# EasyEDA Pro project ProPrj_机器人控制器电源1号_2024-10-14.epro

# Schematic Schematic1
Board Name: Board1; Create Date: 2024-10-03
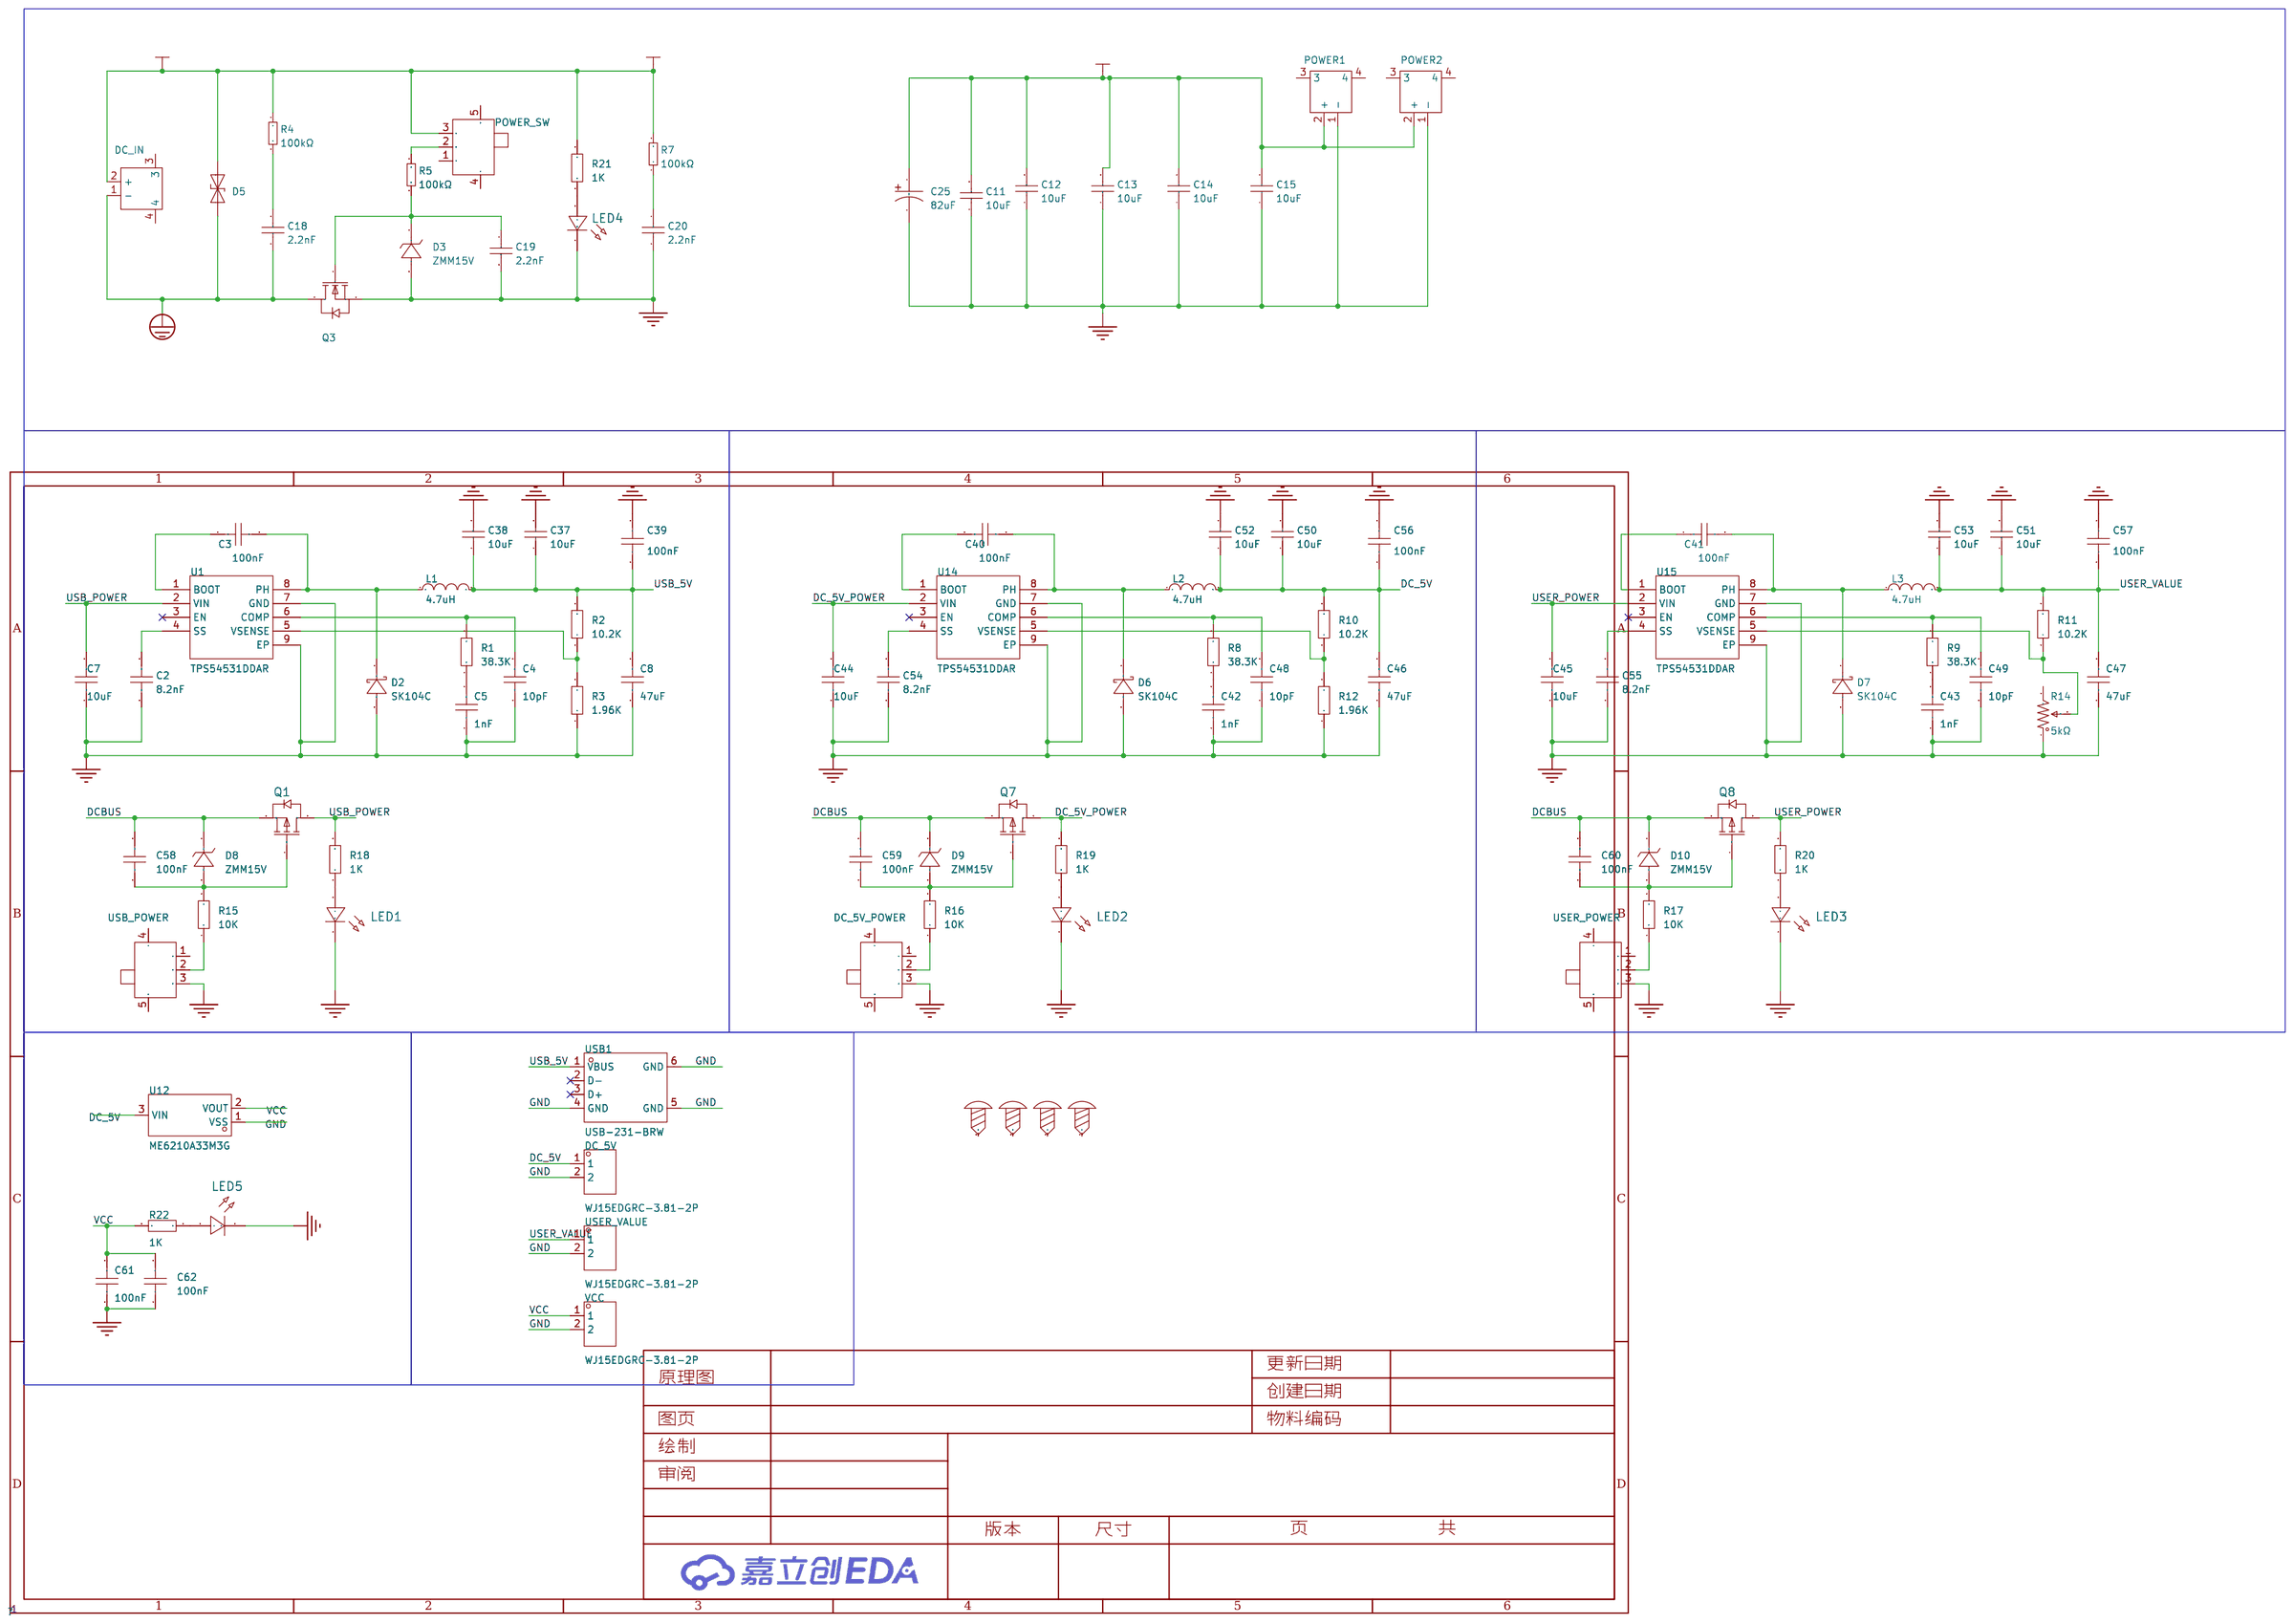
[diagram p0: schematic sheet]

## Parts
C2  8.2nF  [C0603]
C3  100nF  [C0603]
C4  10pF  [C0603]
C5  1nF  [C0603]
C7  10uF  [C1210]
C8  47uF  [C1210]
C11  10uF  [C1206_S]
C12  10uF  [C1206_S]
C13  10uF  [C1206_S]
C14  10uF  [C1206_S]
C15  10uF  [C1206_S]
C18  2.2nF  [C0603]
C19  2.2nF  [C0603]
C20  2.2nF  [C0603]
C25  82uF  [CAP-SMD_BD10.0-L10.3-W10.3-LS11.0-R-RD]
C37  10uF  [C1206_S]
C38  10uF  [C1206_S]
C39  100nF  [C0603]
C40  100nF  [C0603]
C41  100nF  [C0603]
C42  1nF  [C0603]
C43  1nF  [C0603]
C44  10uF  [C1210]
C45  10uF  [C1210]
C46  47uF  [C1210]
C47  47uF  [C1210]
C48  10pF  [C0603]
C49  10pF  [C0603]
C50  10uF  [C1206_S]
C51  10uF  [C1206_S]
C52  10uF  [C1206_S]
C53  10uF  [C1206_S]
C54  8.2nF  [C0603]
C55  8.2nF  [C0603]
C56  100nF  [C0603]
C57  100nF  [C0603]
C58  100nF  [C0603]
C59  100nF  [C0603]
C60  100nF  [C0603]
C61  100nF  [C0603]
C62  100nF  [C0603]
D2  SK104C  [SMC_L6.9-W5.9-LS7.9-RD]
D3  ZMM15V  [LL-34_L3.5-W1.5-RD-2]
D5  1.5SMC30CAHE3/57T  [SMC_L6.8-W5.9-LS7.8-BI]
D6  SK104C  [SMC_L6.9-W5.9-LS7.9-RD]
D7  SK104C  [SMC_L6.9-W5.9-LS7.9-RD]
D8  ZMM15V  [LL-34_L3.5-W1.5-RD-2]
D9  ZMM15V  [LL-34_L3.5-W1.5-RD-2]
D10  ZMM15V  [LL-34_L3.5-W1.5-RD-2]
DC_5V  WJ15EDGRC-3.81-2P  [CONN-TH_2P-P3.81_WJ15EDGRC-3.81-2P]
DC_5V_POWER  SS12D07VG4 087  [SW-TH_SS12D07VG4]
DC_IN  XT30PW-M30.G.Y  [CONN-TH_XT30PW-M]
L1  4.7uH  [IND-SMD_L7.3-W6.6_MHCI06030]
L2  4.7uH  [IND-SMD_L7.3-W6.6_MHCI06030]
L3  4.7uH  [IND-SMD_L7.3-W6.6_MHCI06030]
LED1  -  [LED_0603]
LED2  -  [LED_0603]
LED3  -  [LED_0603]
LED4  -  [LED_0603]
LED5  -  [LED_0603]
POWER1  XT30PW-M30.G.Y  [CONN-TH_XT30PW-M]
POWER2  XT30PW-M30.G.Y  [CONN-TH_XT30PW-M]
POWER_SW  SS12D07VG4 087  [SW-TH_SS12D07VG4]
Q1  WSD90P06DN56  [DFN-8_L5.8-W4.9-P1.27-LS6.0-BL-1]
Q3  WSD80120DN56  [DFN-8_L5.8-W4.9-P1.27-LS6.0-BL-1]
Q7  WSD90P06DN56  [DFN-8_L5.8-W4.9-P1.27-LS6.0-BL-1]
Q8  WSD90P06DN56  [DFN-8_L5.8-W4.9-P1.27-LS6.0-BL-1]
R1  38.3K  [R0603]
R2  10.2K  [R0603]
R3  1.96K  [R0603]
R4  100kΩ  [R0603]
R5  100kΩ  [R0603]
R7  100kΩ  [R0603]
R8  38.3K  [R0603]
R9  38.3K  [R0603]
R10  10.2K  [R0603]
R11  10.2K  [R0603]
R12  1.96K  [R0603]
R14  5kΩ  [RES-ADJ-TH_3362P]
R15  10K  [R0603]
R16  10K  [R0603]
R17  10K  [R0603]
R18  1K  [R0603]
R19  1K  [R0603]
R20  1K  [R0603]
R21  1K  [R0603]
R22  1K  [R0603]
SCREW1  -  [M3螺丝]
SCREW2  -  [M3螺丝]
SCREW3  -  [M3螺丝]
SCREW4  -  [M3螺丝]
U1  TPS54531DDAR  [SOIC-8_L5.0-W4.0-P1.27-LS6.0-BL-EP2.0]
U12  ME6210A33M3G  [SOT-23-3_L3.0-W1.7-P0.95-LS2.9-BR]
U14  TPS54531DDAR  [SOIC-8_L5.0-W4.0-P1.27-LS6.0-BL-EP2.0]
U15  TPS54531DDAR  [SOIC-8_L5.0-W4.0-P1.27-LS6.0-BL-EP2.0]
USB1  USB-231-BRW  [USB-A-TH_USB-231-ARY]
USB_POWER  SS12D07VG4 087  [SW-TH_SS12D07VG4]
USER_POWER  SS12D07VG4 087  [SW-TH_SS12D07VG4]
USER_VALUE  WJ15EDGRC-3.81-2P  [CONN-TH_2P-P3.81_WJ15EDGRC-3.81-2P]
VCC  WJ15EDGRC-3.81-2P  [CONN-TH_2P-P3.81_WJ15EDGRC-3.81-2P]

## Library data of the parts
C2-C5 C39-C43 C48 C49 C54-C62 = CAP_0603: Supplier Footprint: 0603
C7 C44 C45 = CL32B106KBJNNNE: 容值:10uF;精度:±10%;额定电压:50V;材质(温度系数):X7R;; LCSC Part Name: 10uF ±10% 50V; Supplier Part: C138687; Manufacturer: SAMSUNG(三星); Supplier Footprint: 1210; JLCPCB Part Class: 扩展库; Datasheet: https://atta.szlcsc.com/upload/public/pdf/source/20190426/C138687_F326FA7378191C6A10A83DC717674AAD.pdf; Supplier: LCSC; Tolerance: ±10%; Voltage Rated: 50V; Temperature Coefficient: X7R
C8 C46 C47 = CC1210KKX5R7BB476: 容值:47uF;精度:±10%;额定电压:16V;材质(温度系数):X5R;; LCSC Part Name: 47uF ±10% 16V; Supplier Part: C596320; Manufacturer: YAGEO(国巨); Supplier Footprint: 1210; JLCPCB Part Class: 扩展库; Datasheet: https://atta.szlcsc.com/upload/public/pdf/source/20200609/C596320_4AA18BB2F8C351B9C9A1DF92409464C0.pdf; Supplier: LCSC; Tolerance: ±10%; Voltage Rated: 16V; Temperature Coefficient: X5R
C11-C15 C37 C38 C50-C53 = C1206_S: Pin Type: IN; 值: 10UF
C18-C20 = 0603B222K500NT: 容值:2.2nF;精度:±10%;额定电压:50V;材质(温度系数):X7R;; LCSC Part Name: 2.2nF ±10% 50V; Supplier Part: C1604; Manufacturer: FH(风华); Supplier Footprint: 0603; JLCPCB Part Class: Basic Part; Datasheet: https://atta.szlcsc.com/upload/public/pdf/source/20200305/C486355_26A10D38EF8C2A5C37091D0039909270.pdf; Supplier: LCSC; Tolerance: ±10%; Voltage Rated: 50V; Temperature Coefficient: X7R; Pin Type: IN
C25 = VKME1001K820MV: 容值:82uF;精度:±20%;额定电压:80V;纹波电流:668mA@100kHz;等效串联电阻:-;; LCSC Part Name: 82uF ±20% 80V; Supplier Part: C487408; Manufacturer: Ymin(永铭); Supplier Footprint: SMD,D10xL10mm; JLCPCB Part Class: 扩展库; Datasheet: https://atta.szlcsc.com/upload/public/pdf/source/20200220/C487408_31B911397251F741AFB3AE80DF240EFB.pdf; Supplier: LCSC; Tolerance: ±20%; Rated Voltage: 80V; φD: 10mm; L: 10mm; Ripple Current: 668mA@100kHz; Lifetime @ Temp: 10000hrs@105℃; Operating Temperature: -55℃~+105℃
D2 D6 D7 = SK104C_C18199211: 二极管配置:独立式;正向压降(Vf):550mV@10A;直流反向耐压(Vr):40V;平均整流电流(Io):10A;; LCSC Part Name: 电压:40V 电流:10A; Supplier Part: C18199211; Manufacturer: 宏迦橙; Supplier Footprint: SMC; JLCPCB Part Class: 扩展库; Datasheet: https://atta.szlcsc.com/upload/public/pdf/source/20230925/90F2340DC9BC2B2517F18AABBBD1A464.pdf; Supplier: LCSC; Diode Configuration: 独立式; Forward Voltage (Vf@If): 550mV@10A; Reverse Voltage (Vr): 40V; Average Rectified Current (Io): 10A; Reverse Leakage Current (Ir): 500uA@40V; Peak forward surge current: 175A
D3 D8-D10 = ZMM15V: 二极管配置:独立式;稳压值(标称值):15V;稳压值(范围):13.8V~15.6V;功率:500mW;精度:±5%;; Supplier Part: C2891755; Manufacturer: YONGYUTAI(永裕泰); Supplier Footprint: LL-34; JLCPCB Part Class: Extended Part; Datasheet: https://atta.szlcsc.com/upload/public/pdf/source/20210901/1E62BEB6ADBB84BC625F53DAC2865793.pdf; Supplier: LCSC; Diode Configuration: 独立式; Zener Voltage (Nom): 15V; Zener Voltage (Range): 13.8V~15.6V; Power Dissipation: 500mW; Zener Impedance (Zzt): 30Ω; Tolerance: ±5%
D5 = 1.5SMC30CAHE3/57T: Supplier Part: C266791; Manufacturer: VISHAY(威世); Supplier Footprint: DO-214AB; JLCPCB Part Class: ExtendedPart; Datasheet: https://atta.szlcsc.com/upload/public/pdf/source/20201127/C266791_DCFCBF6E8C40544EF502CA57B31F9E9C.pdf; Supplier: LCSC
DC_5V USER_VALUE VCC = WJ15EDGRC-3.81-2P: 连接器类型:板端/插座-闭口;固定方式:-;结构:1x2P;间距:3.81mm;颜色:-;安装方式:弯针;排数:1;每排PIN数:2;额定电流:8A;额定电压:300V;线规 - AWG:-;线规 - 平方毫米:-;触头材质:黄铜;触头镀层:锡;工作温度范围:-40℃~+105℃;焊接温度(最大值):-;; LCSC Part Name: 1x2P 3.81mm 排数:1 每排P数:2; Supplier Part: C8387; Manufacturer: KANGNEX(康奈克斯电气); Supplier Footprint: 弯插,P=3.81mm; JLCPCB Part Class: 扩展库; Datasheet: https://atta.szlcsc.com/upload/public/pdf/source/20191225/C8387_8EBAF10345D2762F0167C8753398EEFA.pdf; Supplier: LCSC; Connector Type: 板端/插座-闭口; Structure: 1x2P; Pitch: 3.81mm; Mounting Style: 弯针; Number of Pins: 2P; Number of Rows: 1; Number of PINs Per Row: 2; Current Rating (Max): 8A; Voltage Rating (Max): 300V; Contact Material: 黄铜; Contact Plating: 锡; Operating Temperature Range: -40℃~+105℃
DC_5V_POWER POWER_SW USB_POWER USER_POWER = SS12D07VG4 087: 电路结构:单刀双掷;安装方式:直插;开关颜色:-;额定电流(DC):500mA;额定电压(DC):50V;额定电流(AC):-;额定电压(AC):-;机械寿命:5千次;; Supplier Part: C2939726; Manufacturer: SHOU HAN(首韩); Supplier Footprint: 插件; JLCPCB Part Class: 扩展库; Datasheet: https://atta.szlcsc.com/upload/public/pdf/source/20220106/E715996F66241B9FD900079FF66489BE.pdf; Supplier: LCSC; Circuit: 单刀双掷; Pin Style: PC引脚; Switch Length: 8.7mm; Switch Width: 4.4mm; Switch Height: 4.7mm; Mounting Style: 直插; Current Rating (DC): 500mA; Voltage Rating (DC): 50V; Mechanical Life: 5千次; Operating Temperature: -10℃~+50℃
DC_IN POWER1 POWER2 = XT30PW-M30.G.Y: 类别:-;类型1:-;; LCSC Part Name: AMASS(艾迈斯)航模插头 卧式弯脚 XT30PW-M公头; Supplier Part: C431092; Manufacturer: AMASS(艾迈斯); JLCPCB Part Class: 扩展库; Datasheet: https://atta.szlcsc.com/upload/public/pdf/source/20220222/6A9F22F7850E25B33E1BE430ADF8560B.pdf; Supplier: LCSC; Type: 航模插头; RatedVoltage: DC 500V; InterfaceType: 公头; RatedCurrent: 15A; RecommendedWireGauge: 16/18/20AWG; contact resistance: 1.2mΩ; specifications: 2pin
L1-L3 = SMMS0630-4R7M: 电感值:4.7uH;精度:±20%;额定电流:-;饱和电流(Isat):6.55A;类型:一体成型电感;; LCSC Part Name: 4.7uH ±20% 6.55A; Supplier Part: C128688; Manufacturer: SXN(顺翔诺); Supplier Footprint: SMD,6.6x7.3mm; JLCPCB Part Class: 扩展库; Datasheet: https://atta.szlcsc.com/upload/public/pdf/source/20210810/BBF24330FB2F5029F637830BA9C42C0D.pdf; Supplier: LCSC; Tolerance: ±20%; Saturation Current (Isat): 6.55A; DC Resistance (DCR): 40mΩ; Type: 一体成型电感
LED1-LED5 = LED_0603-R: Supplier Footprint: 0603
Q1 Q7 Q8 = WSD90P06DN56: Supplier: LCSC; Supplier Part: C719104; JLCPCB Part Class: ExtendedPart; Manufacturer: WinsokSemicon
Q3 = WSD80120DN56: Configuration Single Type N-Ch VDS(V) 85 VGS(V) 25 ID(A)Max. 120 VGS(th)(v) 3 RDS(ON)(m?)@4.218V - Qg(nC)@4.5V - QgS(nC) 17 Qgd(nC) 11 Ciss(pF) 3750 Coss(pF) 395 Crss(pF) 180; Supplier Part: C2880467; Manufacturer: WINSOK(微硕); Supplier Footprint: DFN-8(4.9x5.8); JLCPCB Part Class: 扩展库; Datasheet: https://atta.szlcsc.com/upload/public/pdf/source/20210813/DD2210B50993633CFB622FAE7AD52E64.pdf; Supplier: LCSC; Check: true
R1-R3 R8-R12 R15-R22 = Res_0603: Supplier Footprint: 0603
R4 R5 R7 = RC0603FR-07100KL: 电阻类型:厚膜电阻;阻值:100kΩ;精度:±1%;功率:100mW;最大工作电压:75V;温度系数:±100ppm/℃;; LCSC Part Name: 厚膜电阻 100kΩ ±1% 100mW; Supplier Part: C14675; Manufacturer: YAGEO(国巨); Supplier Footprint: 0603; JLCPCB Part Class: Extended Part; Datasheet: https://atta.szlcsc.com/upload/public/pdf/source/20140324/1457707028752.pdf; Supplier: LCSC; Type: 厚膜电阻; Tolerance: ±1%; Power(Watts): 100mW; Overload Voltage (Max): 75V; Temperature Coefficient: ±100ppm/℃; Operating Temperature Range: -55℃~+155℃; Pin Type: IN
R14 = 3362P-1-502: 阻值:5kΩ;精度:±10%;; LCSC Part Name: 5kΩ ±10%; Supplier Part: C118903; Manufacturer: BOCHEN(博晨); Supplier Footprint: 插件; JLCPCB Part Class: 扩展库; Datasheet: https://atta.szlcsc.com/upload/public/pdf/source/20171114/C118903_15106326539181117393.pdf; Supplier: LCSC; Tolerance: ±10%
SCREW1-SCREW4 = M3螺丝: Supplier Footprint: 插件
U1 U14 U15 = TPS54531DDAR: 功能类型:降压型;输出类型:可调;输入电压:3.5V~28V;输出电压:800mV~26.04V;输出电流(最大值):5A;; Supplier Part: C50605; Manufacturer: TI(德州仪器); Supplier Footprint: SOIC-8-EP; JLCPCB Part Class: 扩展库; Datasheet: https://www.ti.com/cn/lit/gpn/tps54531; Supplier: LCSC; Function: 降压型; Output Type: 可调; Input Voltage: 3.5V~28V; Output Voltage: 800mV~26.04V; Output Current (Max): 5A; Switching Frequency: 570kHz; Operating Temperature: -40℃~+85℃@(TA); Synchronous Rectification: 否; Number of Outputs: 1; Topology: 降压式; Switch tube (built-in/external): 内置
U12 = ME6210A33M3G: 输出类型:固定;最大输入电压:18V;输出电压:3.3V;最大输出电流:500mA;电源纹波抑制比(PSRR):-;输出极性:正极;; LCSC Part Name: 输入18V 输出3.3V 500mA; Supplier Part: C236680; Manufacturer: MICRONE(南京微盟); Supplier Footprint: SOT-23; JLCPCB Part Class: 扩展库; Datasheet: https://atta.szlcsc.com/upload/public/pdf/source/20190709/C403652_164B03470289BC6E2EF0FCF22B47472A.pdf; Supplier: LCSC; Output Type: 固定; Maximum Input Voltage: 18V; Output Voltage: 3.3V; MAX Output Current: 500mA; Dropout Voltage: 260mV@(200mA); Output Polarity: 正极; Number of Outputs: 1
USB1 = USB-231-BRW: 连接器类型:Type-A;标准:USB 2.0;公母:母;端口数量:1;触点数量:4P;安装方式:弯插;额定电流 - 电源:1.5A;触头材质:-;触头镀层:-;工作温度范围:-20℃~+70℃;焊接温度(最大值):260℃;; LCSC Part Name: Type-A 母 弯插; Supplier Part: C720526; Manufacturer: XUNPU(讯普); Supplier Footprint: 插件; JLCPCB Part Class: 扩展库; Datasheet: https://atta.szlcsc.com/upload/public/pdf/source/20200810/C720526_4837E23757308E8DFF7007387B1B5646.pdf; Supplier: LCSC; Connector Type: Type-A; Standard: USB 2.0; Gender: 母; Number of Ports: 1; Number of Contacts: 4P; Mounting Style: 弯插; Current Rating - Power (Max): 1.5A; Operating Temperature Range: -20℃~+70℃; Soldering Temperature(Max): 260℃

## Nets
GND: C2.1 C4.1 C5.1 C7.1 C8.1 C11.1 C12.1 C13.1 C14.1 C15.1 C19.2 C20.2 C25.2 C37.2 C38.2 C39.2 C42.1 C43.1 C44.1 C45.1 C46.1 C47.1 C48.1 C49.1 C50.2 C51.2 C52.2 C53.2 C54.1 C55.1 C56.2 C57.2 C61.1 C62.1 D2.2(A) D3.2(A) D6.2(A) D7.2(A) DC_5V.2 DC_5V_POWER.3 LED1.1(C) LED2.1(C) LED3.1(C) LED4.1(C) LED5.1(C) POWER1.1(-) POWER2.1(-) Q3.3(S) R3.1 R12.1 R14.1 U1.7(GND) U1.9(EP) U12.1(VSS) U14.7(GND) U14.9(EP) U15.7(GND) U15.9(EP) USB1.4(GND) USB1.5(GND) USB1.6(GND) USB_POWER.3 USER_POWER.3 USER_VALUE.2 VCC.2
PGND: C18.2 D5.1(K) DC_IN.1(-) Q3.2(D)
VCC: C61.2 C62.2 R22.2 U12.2(VOUT) VCC.1
DC_5V: C46.2 C50.1 C52.1 C56.1 DC_5V.1 L2.2 R10.2 U12.3(VIN)
DC_5V_POWER: C44.2 Q7.2(D) R19.2 U14.2(VIN)
DCBUS: C11.2 C12.2 C13.2 C14.2 C15.2 C25.1 C58.2 C59.2 C60.2 D5.2(A) D8.1(K) D9.1(K) D10.1(K) DC_IN.2(+) POWER1.2(+) POWER2.2(+) POWER_SW.3 Q1.3(S) Q7.3(S) Q8.3(S) R4.2 R7.2 R21.2
USB_5V: C8.2 C37.1 C38.1 C39.1 L1.2 R2.2 USB1.1(VBUS)
USB_POWER: C7.2 Q1.2(D) R18.2 U1.2(VIN)
USER_POWER: C45.2 Q8.2(D) R20.2 U15.2(VIN)
USER_VALUE: C47.2 C51.1 C53.1 C57.1 L3.2 R11.2 USER_VALUE.1
$1N473: C2.2 U1.4(SS)
$1N474: C3.1 U1.1(BOOT)
$1N475: C5.2 R1.1
$1N478: C3.2 D2.1(K) L1.1 U1.8(PH)
$1N479: C4.2 R1.2 U1.6(COMP)
$1N480: R2.1 R3.2 U1.5(VSENSE)
$1N1302: C20.1 R7.1
$1N1310: C18.1 R4.1
$1N1311: C19.1 D3.1(K) Q3.1(G) R5.1
$1N2746: POWER_SW.2 R5.2
$1N3758: C48.2 R8.2 U14.6(COMP)
$1N3759: R10.1 R12.2 U14.5(VSENSE)
$1N3762: C42.2 R8.1
$1N3765: C40.1 U14.1(BOOT)
$1N3766: C54.2 U14.4(SS)
$1N3767: C40.2 D6.1(K) L2.1 U14.8(PH)
$1N4267: C49.2 R9.2 U15.6(COMP)
$1N4268: R11.1 R14.2 U15.5(VSENSE)
$1N4271: C43.2 R9.1
$1N4274: C41.1 U15.1(BOOT)
$1N4275: C55.2 U15.4(SS)
$1N4276: C41.2 D7.1(K) L3.1 U15.8(PH)
$1N4769: R15.1 USB_POWER.2
$1N4775: C58.1 D8.2(A) Q1.1(G) R15.2
$1N5019: C59.1 D9.2(A) Q7.1(G) R16.2
$1N5027: DC_5V_POWER.2 R16.1
$1N5219: C60.1 D10.2(A) Q8.1(G) R17.2
$1N5227: R17.1 USER_POWER.2
$1N5355: LED1.2(A) R18.1
$1N5382: LED2.2(A) R19.1
$1N5409: LED3.2(A) R20.1
$1N5711: LED4.2(A) R21.1
$1N5982: LED5.2(A) R22.1

Not connected (* = marked no-connect by the designer): DC_5V_POWER 1 4 5; DC_IN 3 4; POWER1 3 4; POWER2 3 4; POWER_SW 1 4 5; R14 3; SCREW1 1; SCREW2 1; SCREW3 1; SCREW4 1; U1 3(EN)*; U14 3(EN)*; U15 3(EN)*; USB1 2(D-)* 3(D+)*; USB_POWER 1 4 5; USER_POWER 1 4 5

# Board PCB1
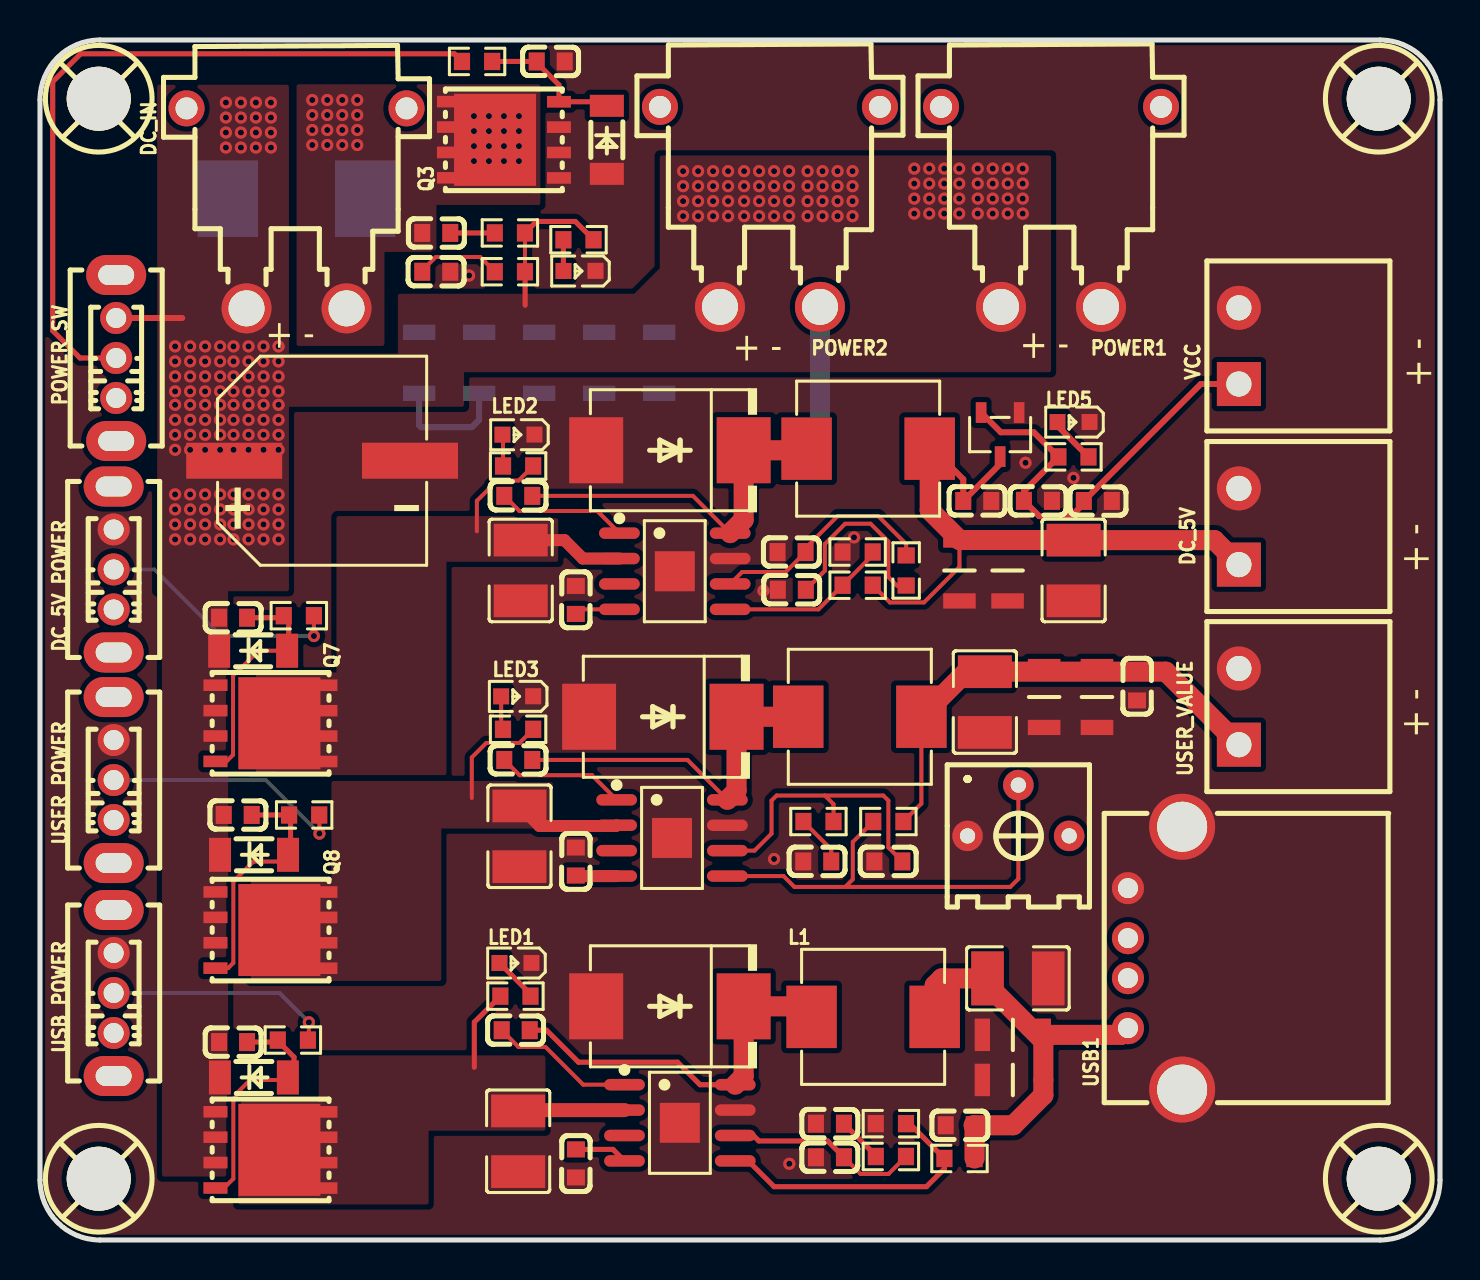
[diagram p1: board, top side]
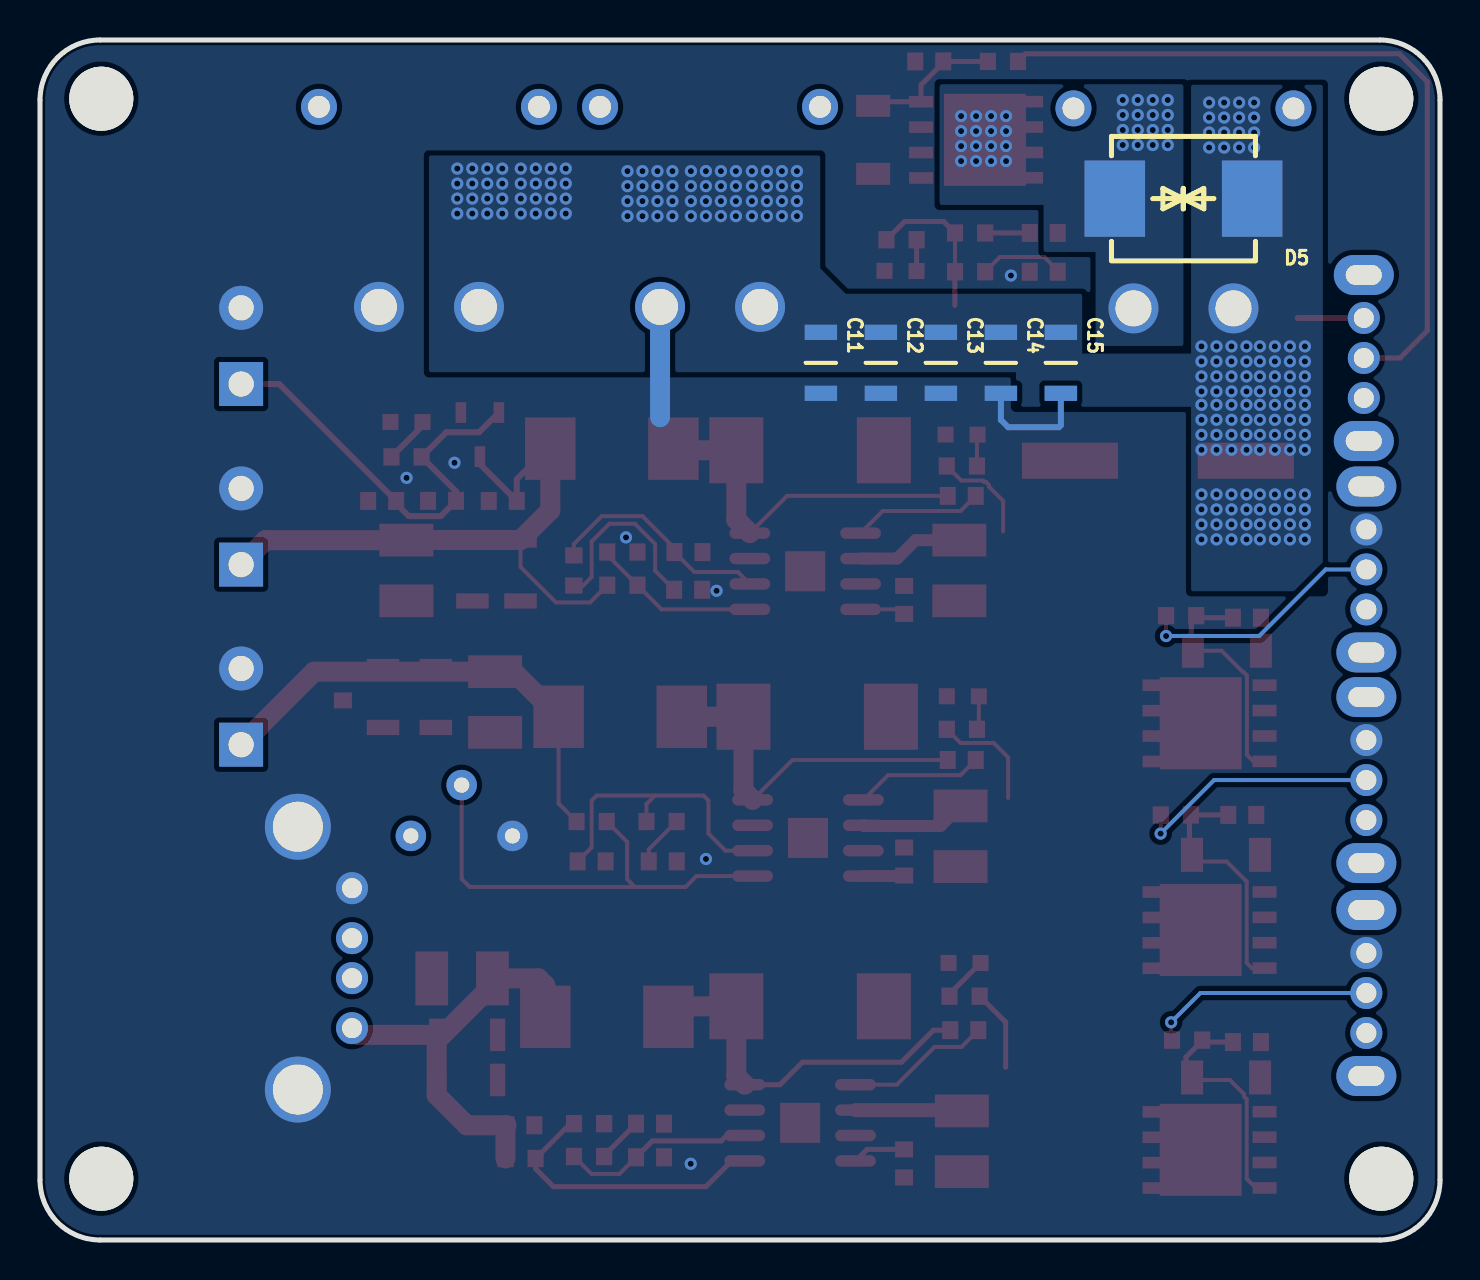
[diagram p2: board, bottom side, seen from below]

Outline 70 x 60 mm; copper layers: Top Layer, Bottom Layer. Coordinates in mm from the lower left corner of the outline.
Outline path: 0,57 0,3 arc(0.88,0.88) 3,0 67,0 arc(69.12,0.88) 70,3 70,57 arc(69.12,59.12) 67,60 3,60 arc(0.88,59.12) 0,57
Stack: Top Layer 0.035mm / Dielectric1 1.51mm FR4 er 4.5 / Bottom Layer 0.035mm

## Design rules (mm)
template: 自定义配置
spacing copperThickness1oz (default): track to track 0.102, other pairs 0.152 to 0.3
spacing copperThickness2oz: track to track 0.203, other pairs 0.152 to 0.3
track width copperThickness1oz (default): min 0.127, default 0.254, max 2.54
track width copperThickness2oz: min 0.203, default 0.254, max 2.54
differential pair differentialPair (default): width min 0.127, default 0.254, max 2.54; gap min 0.152, default 0.152
via viaSize (default): diameter min 0.5, default 0.61, max 10; hole min 0.3, default 0.305, max 6.3

## Placement (name value [footprint] x y rotation side)
C2  8.2nF  [C0603]  26.8 3.83 90 top
C3  100nF  [C0603]  23.79 10.49 0 top
C4  10pF  [C0603]  39.5 4.14 0 top
C5  1nF  [C0603]  39.5 5.81 0 top
C7  10uF  [C1210]  23.91 4.94 90 top
C8  47uF  [C1210]  48.9 13.08 180 top
C11  10uF  [C1206_S]  30.96 43.99 270 bottom
C12  10uF  [C1206_S]  27.96 43.99 270 bottom
C13  10uF  [C1206_S]  24.96 43.99 270 bottom
C14  10uF  [C1206_S]  21.96 43.99 270 bottom
C15  10uF  [C1206_S]  18.96 43.99 270 bottom
C18  2.2nF  [C0603]  19.81 50.35 180 top
C19  2.2nF  [C0603]  25.54 58.93 0 top
C20  2.2nF  [C0603]  19.81 48.41 0 top
C25  82uF  [CAP-SMD_BD10.0-L10.3-W10.3-LS11.0-R-RD]  14.11 38.96 180 top
C37  10uF  [C1206_S]  48.52 8 0 top
C38  10uF  [C1206_S]  48.52 10.26 0 top
C39  100nF  [C0603]  45.99 5.74 180 top
C40  100nF  [C0603]  23.91 37.21 0 top
C41  100nF  [C0603]  23.91 24 0 top
C42  1nF  [C0603]  37.59 32.51 0 top
C43  1nF  [C0603]  38.86 18.93 0 top
C44  10uF  [C1210]  24.03 33.48 90 top
C45  10uF  [C1210]  23.97 20.19 90 top
C46  47uF  [C1210]  51.68 33.48 90 top
C47  47uF  [C1210]  47.24 26.9 90 top
C48  10pF  [C0603]  37.58 34.4 0 top
C49  10pF  [C0603]  42.42 18.93 0 top
C50  10uF  [C1206_S]  45.97 33.35 90 top
C51  10uF  [C1206_S]  52.85 27.02 90 top
C52  10uF  [C1206_S]  48.38 33.35 90 top
C53  10uF  [C1206_S]  50.21 27.02 90 top
C54  8.2nF  [C0603]  26.79 32 270 top
C55  8.2nF  [C0603]  26.79 18.92 270 top
C56  100nF  [C0603]  46.86 36.95 0 top
C57  100nF  [C0603]  54.85 27.68 270 top
C58  100nF  [C0603]  9.65 9.9 180 top
C59  100nF  [C0603]  9.65 31.11 180 top
C60  100nF  [C0603]  9.89 21.25 180 top
C61  100nF  [C0603]  52.89 36.95 180 top
C62  100nF  [C0603]  49.9 36.96 180 top
D2  SK104C  [SMC_L6.9-W5.9-LS7.9-RD]  31.5 11.68 180 top
D3  ZMM15V  [LL-34_L3.5-W1.5-RD-2]  28.34 55.01 270 top
D5  1.5SMC30CAHE3/57T  [SMC_L6.8-W5.9-LS7.8-BI]  12.83 52.07 0 bottom
D6  SK104C  [SMC_L6.9-W5.9-LS7.9-RD]  31.5 39.49 180 top
D7  SK104C  [SMC_L6.9-W5.9-LS7.9-RD]  31.14 26.16 180 top
D8  ZMM15V  [LL-34_L3.5-W1.5-RD-2]  10.69 8.13 0 top
D9  ZMM15V  [LL-34_L3.5-W1.5-RD-2]  10.66 29.46 0 top
D10  ZMM15V  [LL-34_L3.5-W1.5-RD-2]  10.7 19.26 0 top
DC_5V  WJ15EDGRC-3.81-2P  [CONN-TH_2P-P3.81_WJ15EDGRC-3.81-2P]  59.94 35.67 90 top
DC_5V_POWER  SS12D07VG4 087  [SW-TH_SS12D07VG4]  3.68 33.53 90 top
DC_IN  XT30PW-M30.G.Y  [CONN-TH_XT30PW-M]  12.83 51.58 180 top
L1  4.7uH  [IND-SMD_L7.3-W6.6_MHCI06030]  41.66 11.16 0 top
L2  4.7uH  [IND-SMD_L7.3-W6.6_MHCI06030]  41.41 39.57 0 top
L3  4.7uH  [IND-SMD_L7.3-W6.6_MHCI06030]  40.99 26.16 0 top
LED1  -  [LED_0603]  23.72 13.85 180 top
LED2  -  [LED_0603]  23.87 40.26 180 top
LED3  -  [LED_0603]  23.81 27.18 180 top
LED4  -  [LED_0603]  26.92 48.45 180 top
LED5  -  [LED_0603]  51.62 40.89 180 top
POWER1  XT30PW-M30.G.Y  [CONN-TH_XT30PW-M]  50.55 51.66 180 top
POWER2  XT30PW-M30.G.Y  [CONN-TH_XT30PW-M]  36.5 51.66 180 top
POWER_SW  SS12D07VG4 087  [SW-TH_SS12D07VG4]  3.81 44.1 90 top
Q1  WSD90P06DN56  [DFN-8_L5.8-W4.9-P1.27-LS6.0-BL-1]  11.52 4.5 270 top
Q3  WSD80120DN56  [DFN-8_L5.8-W4.9-P1.27-LS6.0-BL-1]  23.2 55.01 90 top
Q7  WSD90P06DN56  [DFN-8_L5.8-W4.9-P1.27-LS6.0-BL-1]  11.52 25.83 270 top
Q8  WSD90P06DN56  [DFN-8_L5.8-W4.9-P1.27-LS6.0-BL-1]  11.52 15.5 270 top
R1  38.3K  [R0603]  42.54 4.18 0 top
R2  10.2K  [R0603]  45.97 4.08 0 top
R3  1.96K  [R0603]  42.54 5.82 0 top
R4  100kΩ  [R0603]  23.5 50.35 0 top
R5  100kΩ  [R0603]  21.85 58.93 180 top
R7  100kΩ  [R0603]  23.5 48.41 0 top
R8  38.3K  [R0603]  43.31 33.48 90 top
R9  38.3K  [R0603]  38.92 20.92 0 top
R10  10.2K  [R0603]  40.88 32.74 0 top
R11  10.2K  [R0603]  42.42 20.92 0 top
R12  1.96K  [R0603]  40.88 34.4 0 top
R14  5kΩ  [RES-ADJ-TH_3362P]  48.92 21.47 0 top
R15  10K  [R0603]  12.64 10 180 top
R16  10K  [R0603]  12.94 31.22 180 top
R17  10K  [R0603]  13.21 21.25 180 top
R18  1K  [R0603]  23.77 12.19 180 top
R19  1K  [R0603]  23.91 38.7 0 top
R20  1K  [R0603]  23.9 25.54 0 top
R21  1K  [R0603]  26.92 50.01 0 top
R22  1K  [R0603]  51.67 39.16 180 top
SCREW1  -  [M3螺丝]  3 57 0 top
SCREW2  -  [M3螺丝]  3 3 0 top
SCREW3  -  [M3螺丝]  67 57 0 top
SCREW4  -  [M3螺丝]  67 3 0 top
U1  TPS54531DDAR  [SOIC-8_L5.0-W4.0-P1.27-LS6.0-BL-EP2.0]  31.99 5.86 270 top
U12  ME6210A33M3G  [SOT-23-3_L3.0-W1.7-P0.95-LS2.9-BR]  48.01 40.27 90 top
U14  TPS54531DDAR  [SOIC-8_L5.0-W4.0-P1.27-LS6.0-BL-EP2.0]  31.74 33.44 270 top
U15  TPS54531DDAR  [SOIC-8_L5.0-W4.0-P1.27-LS6.0-BL-EP2.0]  31.6 20.1 270 top
USB1  USB-231-BRW  [USB-A-TH_USB-231-ARY]  55.75 14.09 90 top
USB_POWER  SS12D07VG4 087  [SW-TH_SS12D07VG4]  3.68 12.35 90 top
USER_POWER  SS12D07VG4 087  [SW-TH_SS12D07VG4]  3.68 23 90 top
USER_VALUE  WJ15EDGRC-3.81-2P  [CONN-TH_2P-P3.81_WJ15EDGRC-3.81-2P]  59.94 26.67 90 top
VCC  WJ15EDGRC-3.81-2P  [CONN-TH_2P-P3.81_WJ15EDGRC-3.81-2P]  59.94 44.7 90 top

## Footprints (pads in the part's own frame, mm; a bottom-side part is the same pattern mirrored in y, then rotated)
C0603
  rect 0.8x0.9 smd: 1(-0.7,0) 2(0.7,0)
C1206_S
  rect 0.762x1.625 smd: 1(1.651,0) 2(-1.397,0)
C1210
  rect 1.635x2.7 smd: 1(-1.518,0) 2(1.518,0)
CAP-SMD_BD10.0-L10.3-W10.3-LS11.0-R-RD
  rect 4.8x1.8 smd: 1(4.395,0) 2(-4.395,0)
CONN-TH_2P-P3.81_WJ15EDGRC-3.81-2P
  rect 2.2x2.2 hole 1.26: 1(-1.905,0)
  round 2.2 hole 1.26: 2(1.905,0)
CONN-TH_XT30PW-M
  round 2.5 hole 1.8: 1(-2.5,5) 2(2.5,5)
  round 1.8 hole 1.1: 3(5.5,-5) 4(-5.5,-5)
DFN-8_L5.8-W4.9-P1.27-LS6.0-BL-1
  rect 0.579x1.199 smd: 1(1.903,-2.751) 2(-1.903,2.751) 2(-0.632,2.751) 2(0.637,2.751) 2(1.907,2.751) 3(-1.907,-2.751) 3(-0.637,-2.751) 3(0.632,-2.751)
  rect 4.6x4.099 smd: 2(-0.003,0.445)
IND-SMD_L7.3-W6.6_MHCI06030
  rect 2.524x3.12 smd: 1(-3.078,0) 2(3.078,0)
LED_0603
  rect 0.8x0.8 smd: 1(-0.851,-0.01) 2(0.75,-0.005)
LL-34_L3.5-W1.5-RD-2
  rect 1.1x1.7 smd: 1(-1.7,0) 2(1.7,0)
M3螺丝
  round 3.2 hole 3.2: 1(-0.064,0.064)
R0603
  rect 0.806x0.864 smd: 1(-0.753,0) 2(0.753,0)
RES-ADJ-TH_3362P
  round 1.524 hole 0.762: 1(-2.54,-1.27) 2(0,1.27) 3(2.54,-1.27)
SMC_L6.8-W5.9-LS7.8-BI
  rect 3.03x3.82 smd: 1(3.434,0) 2(-3.434,0)
SMC_L6.9-W5.9-LS7.9-RD
  rect 2.7x3.3 smd: 1(-3.687,0) 2(3.687,0)
SOIC-8_L5.0-W4.0-P1.27-LS6.0-BL-EP2.0
  oval 0.574x2.038 smd: 1(-1.905,-2.769) 2(-0.635,-2.769) 3(0.635,-2.769) 4(1.905,-2.769) 5(1.905,2.769) 6(0.635,2.769) 7(-0.635,2.769) 8(-1.905,2.769)
  rect 2x2 smd: 9(0,0)
SOT-23-3_L3.0-W1.7-P0.95-LS2.9-BR
  rect 1.038x0.532 smd: 1(1.101,-0.95) 2(1.101,0.95) 3(-1.101,0)
SW-TH_SS12D07VG4
  oval 1.6x1.6 hole 1: 1(-2,0) 2(0,0) 3(2,0)
  oval 2x3 hole 1x1.8: 4(4.15,0) 5(-4.15,0)
USB-A-TH_USB-231-ARY
  round 1.6 hole 1: 1(-3.5,1.355) 2(-1,1.355) 3(1,1.355) 4(3.5,1.355)
  round 3.3 hole 2.5: 5(-6.57,-1.355) 6(6.57,-1.355)

## Nets
As in the schematic.

Pads without a net: DC_5V_POWER 1 4 5; DC_IN 3 4; POWER1 3 4; POWER2 3 4; POWER_SW 1 4 5; R14 3; SCREW1 1; SCREW2 1; SCREW3 1; SCREW4 1; U1 3; U14 3; U15 3; USB1 2 3; USB_POWER 1 4 5; USER_POWER 1 4 5

## Via types
v1: diameter 0.61, hole 0.305, Top Layer to Bottom Layer, 234 vias

## Routing (per net, layer and track width the routed paths; a pad name or vN(x,y) marks a point on that pad's centre or on a via; arc(x,y) is an arc through that point)
GND: length 11.6
  Bottom Layer w0.3: C15.1 18.96,40.73 19.05,40.64 21.59,40.64 21.96,41.01 C14.1
  Bottom Layer w1: POWER2.1 39,41.14
  vias: v1(21.45,48.22) v1(36.17,32.46) v1(36.7,19.05) v1(37.47,3.81) v1(40.7,35.13) v1(49.28,38.86) v1(51.67,38.11)
PGND:
  vias: v1(13.61,57) v1(13.61,56.25) v1(13.61,55.5) v1(13.61,54.75) v1(14.36,57) v1(14.36,56.25) v1(14.36,55.5) v1(14.36,54.75) v1(15.11,57) v1(15.11,56.25) v1(15.11,55.5) v1(15.11,54.75) v1(15.86,57) v1(15.86,56.25) v1(15.86,55.5) v1(15.86,54.75) v1(21.7,56.2) v1(21.7,55.45) v1(21.7,54.7) v1(21.7,53.95) v1(22.45,56.2) v1(22.45,55.45) v1(22.45,54.7) v1(22.45,53.95) v1(23.2,56.2) v1(23.2,55.45) v1(23.2,54.7) v1(23.2,53.95) v1(23.95,56.2) v1(23.95,55.45) v1(23.95,54.7) v1(23.95,53.95)
VCC: length 21.7
  Top Layer w0.3: 60.07,42.8 58.04,42.8 C61.2 52.19,36.83 51.56,36.19 49.96,36.19 C62.2 49.2,37.43 R22.2 49.69,40.39 48.04,40.39 U12.2
DC_5V: length 32.2
  Top Layer w0.2: R10.2 42.5,31.88 44.2,31.88 45.97,33.66 C50.1
  Top Layer w0.3: U12.3 48.01,38.8 C56.1 46.16,38.04 44.96,39.24
  Top Layer w1: DC_5V.1 58.72,34.99 C46.2 51.67,35 C52.1 C50.1 44.49,36.49 L2.2
DC_5V_POWER: length 10.4
  Top Layer w0.2: R19.2 23.93,37.97 22.86,37.97 22.79,37.91 22.71,37.91 22.56,37.76 22.56,37.67 21.84,36.96 21.84,35.43
  Top Layer w0.6: 28.97,34.07 27.14,34.07 26.22,34.99 C44.2
DCBUS: length 11
  Top Layer w0.2: 24.25,50.35 24.25,48.41
  Top Layer w0.254: 24.25,48.41 24.26,48.41 24.26,46.74 ; 24.25,50.35 24.82,50.93 26.76,50.93 R21.2
  Top Layer w0.3: POWER_SW.3 7.11,46.1
  vias: v1(6.75,44.68) v1(6.75,43.93) v1(6.75,43.18) v1(6.75,42.43) v1(6.75,41.76) v1(6.75,41.01) v1(6.75,40.26) v1(6.75,39.51) v1(6.75,37.28) v1(6.75,36.53) v1(6.75,35.78) v1(6.75,35.03) v1(7.5,44.68) v1(7.5,43.93) v1(7.5,43.18) v1(7.5,42.43) v1(7.5,41.76) v1(7.5,41.01) v1(7.5,40.26) v1(7.5,39.51) v1(7.5,37.28) v1(7.5,36.53) v1(7.5,35.78) v1(7.5,35.03) v1(8.25,44.68) v1(8.25,43.93) v1(8.25,43.18) v1(8.25,42.43) v1(8.25,41.76) v1(8.25,41.01) v1(8.25,40.26) v1(8.25,39.51) v1(8.25,37.28) v1(8.25,36.53) v1(8.25,35.78) v1(8.25,35.03) v1(9,44.68) v1(9,43.93) v1(9,43.18) v1(9,42.43) v1(9,41.76) v1(9,41.01) v1(9,40.26) v1(9,39.51) v1(9,37.28) v1(9,36.53) v1(9,35.78) v1(9,35.03) v1(9.3,56.87) v1(9.3,56.12) v1(9.3,55.37) v1(9.3,54.62) v1(9.68,44.68) v1(9.68,43.93) v1(9.68,43.18) v1(9.68,42.43) v1(9.68,41.76) v1(9.68,41.01) v1(9.68,40.26) v1(9.68,39.51) v1(9.68,37.28) v1(9.68,36.53) v1(9.68,35.78) v1(9.68,35.03) v1(10.05,56.87) v1(10.05,56.12) v1(10.05,55.37) v1(10.05,54.62) v1(10.43,44.68) v1(10.43,43.93) v1(10.43,43.18) v1(10.43,42.43) v1(10.43,41.76) v1(10.43,41.01) v1(10.43,40.26) v1(10.43,39.51) v1(10.43,37.28) v1(10.43,36.53) v1(10.43,35.78) v1(10.43,35.03) v1(10.8,56.87) v1(10.8,56.12) v1(10.8,55.37) v1(10.8,54.62) v1(11.18,44.68) v1(11.18,43.93) v1(11.18,43.18) v1(11.18,42.43) v1(11.18,41.76) v1(11.18,41.01) v1(11.18,40.26) v1(11.18,39.51) v1(11.18,37.28) v1(11.18,36.53) v1(11.18,35.78) v1(11.18,35.03) v1(11.55,56.87) v1(11.55,56.12) v1(11.55,55.37) v1(11.55,54.62) v1(11.93,44.68) v1(11.93,43.93) v1(11.93,43.18) v1(11.93,42.43) v1(11.93,41.76) v1(11.93,41.01) v1(11.93,40.26) v1(11.93,39.51) v1(11.93,37.28) v1(11.93,36.53) v1(11.93,35.78) v1(11.93,35.03) v1(32.16,53.44) v1(32.16,52.69) v1(32.16,51.94) v1(32.16,51.19) v1(32.91,53.44) v1(32.91,52.69) v1(32.91,51.94) v1(32.91,51.19) v1(33.66,53.44) v1(33.66,52.69) v1(33.66,51.94) v1(33.66,51.19) v1(34.41,53.44) v1(34.41,52.69) v1(34.41,51.94) v1(34.41,51.19) v1(35.21,53.44) v1(35.21,52.69) v1(35.21,51.94) v1(35.21,51.19) v1(35.96,53.44) v1(35.96,52.69) v1(35.96,51.94) v1(35.96,51.19) v1(36.71,53.44) v1(36.71,52.69) v1(36.71,51.94) v1(36.71,51.19) v1(37.46,53.44) v1(37.46,52.69) v1(37.46,51.94) v1(37.46,51.19) v1(38.38,53.44) v1(38.38,52.69) v1(38.38,51.94) v1(38.38,51.19) v1(39.13,53.44) v1(39.13,52.69) v1(39.13,51.94) v1(39.13,51.19) v1(39.88,53.44) v1(39.88,52.69) v1(39.88,51.94) v1(39.88,51.19) v1(40.63,53.44) v1(40.63,52.69) v1(40.63,51.94) v1(40.63,51.19) v1(43.71,53.57) v1(43.71,52.82) v1(43.71,52.07) v1(43.71,51.32) v1(44.46,53.57) v1(44.46,52.82) v1(44.46,52.07) v1(44.46,51.32) v1(45.21,53.57) v1(45.21,52.82) v1(45.21,52.07) v1(45.21,51.32) v1(45.96,53.57) v1(45.96,52.82) v1(45.96,52.07) v1(45.96,51.32) v1(46.89,53.57) v1(46.89,52.82) v1(46.89,52.07) v1(46.89,51.32) v1(47.64,53.57) v1(47.64,52.82) v1(47.64,52.07) v1(47.64,51.32) v1(48.39,53.57) v1(48.39,52.82) v1(48.39,52.07) v1(48.39,51.32) v1(49.14,53.57) v1(49.14,52.82) v1(49.14,52.07) v1(49.14,51.32)
USB_5V: length 21.9
  Top Layer w1: USB1.1 54.06,10.26 C38.1 50.17,9.96 ; 50.17,9.96 47.21,12.92 C8.2 45.09,13.08 44.73,12.73 L1.2 ; 50.17,9.96 C37.1 50.17,7.24 48.66,5.74 C39.1 46.73,5.69 R2.2
USB_POWER: length 9.4
  Top Layer w0.254: 21.72,8.64 21.72,10.89 R18.2
  Top Layer w0.7: U1.2 23.95,6.5 C7.2
USER_POWER: length 11
  Top Layer w0.2: R20.2 23.97,24.85 22.31,24.85 21.59,24.13 21.59,22.1
  Top Layer w0.6: U15.2 28.79,20.7 24.98,20.7 C45.2
USER_VALUE: length 23.9
  Top Layer w0.2: L3.2 44.07,21.82 R11.2
  Top Layer w1: L3.2 46.32,28.42 56.29,28.42 USER_VALUE.1
$1N473: length 2.7
  Top Layer w0.254: C2.2 28.65,4.53 U1.4
$1N474: length 7.3
  Top Layer w0.2: C3.1 23.92,9.65 25.27,9.65 27.16,7.76 29.22,7.76
$1N475: length 2.3
  Top Layer w0.254: R1.1 41.79,4.22 C5.2
$1N478: length 19.1
  Top Layer w0.254: C3.2 25.32,10.49 26.92,8.89 31.88,8.89 33,7.76 34.76,7.76
  Top Layer w1: 34.76,7.76 35.18,8.18 D2.1 38.05,11.68 L1.1
$1N479: length 9.7
  Top Layer w0.2: R1.2 42.43,3.3 41.03,3.3 C4.2
  Top Layer w0.254: C4.2 39.38,4.95 35.94,4.95 35.67,5.22 34.76,5.22
$1N480: length 14.5
  Top Layer w0.254: U1.5 35.41,3.96 36.7,2.67 44.32,2.67 45.22,3.56 R2.1 43.48,5.82 R3.2
$1N1302: length 4.3
  Top Layer w0.2: 22.74,48.41 22.01,49.15 19.79,49.15 19.05,48.41
$1N1310: length 2.2
  Top Layer w0.254: 20.57,50.35 22.74,50.35
$1N1311: length 7.1
  Top Layer w0.254: 22.61,58.93 24.77,58.93 25.95,57.75 Q3.1 28.22,56.91 28.34,56.79
$1N2746: length 37.4
  Top Layer w0.254: POWER_SW.2 2,44.1 0.64,45.47 0.64,57.91 2.03,59.31 20.72,59.31 R5.2
$1N3758: length 11.5
  Top Layer w0.2: U14.6 35.11,33.4 37.28,33.4 C48.2 38.28,34.6 39.88,36.19 41.91,36.19 43.31,34.8 R8.2
$1N3759: length 8.4
  Top Layer w0.2: R12.2 41.64,34.25 R10.1 38.92,31.53 U14.5
$1N3762: length 9.5
  Top Layer w0.2: R8.1 42.84,32.72 42.42,33.15 42.42,34.92 41.53,35.81 40.26,35.81 39.24,34.8 39.24,33.46 C42.2
$1N3765: length 6.5
  Top Layer w0.2: U14.1 27.86,36.45 23.97,36.45 C40.1
$1N3766: length 2.3
  Top Layer w0.2: U14.4 27.02,31.53 C54.2
$1N3767: length 18.3
  Top Layer w0.2: C40.2 32.65,37.21 U14.8
  Top Layer w1: L2.1 38.25,39.49 D6.1 35.18,36.02 U14.8
$1N4267: length 15.1
  Top Layer w0.2: R9.2 39.68,21.79 39.24,22.22 ; U15.6 35.72,19.47 36.58,20.32 36.58,21.97 36.83,22.22 39.24,22.22 ; 39.24,22.22 42.16,22.22 42.42,21.97 42.42,19.63 C49.2
$1N4268: length 23.5
  Top Layer w0.2: 40.26,17.65 40.64,18.03 40.64,19.9 R11.1 ; 40.26,17.65 48.51,17.65 48.92,18.06 R14.2 ; 40.26,17.65 37.72,17.65 37.17,18.2 U15.5
$1N4271: length 2.6
  Top Layer w0.2: C43.2 39.56,19.53 R9.1
$1N4274: length 6.4
  Top Layer w0.2: U15.1 27.6,23.24 23.97,23.24 C41.1
$1N4275: length 2.1
  Top Layer w0.6: U15.4 26.82,18.2 C55.2
$1N4276: length 18
  Top Layer w0.2: U15.8 32.37,24 C41.2
  Top Layer w1: U15.8 34.83,22.47 D7.1 L3.1
$1N4769: length 11.3
  Top Layer w0.2: v1(13.44,10.89) 13.44,10.04 R15.1
  Bottom Layer w0.2: USB_POWER.2 11.98,12.35 v1(13.44,10.89)
$1N4775: length 12.2
  Top Layer w0.2: Q1.1 9.21,2.6 9.67,3.06 9.67,7.04 9.8,7.17 9.8,7.29 10.5,8 12.35,8 12.47,8.13
  Top Layer w0.254: 12.47,8.13 12.7,8.35 12.7,9.14 11.95,9.9 C58.1
$1N5019: length 12
  Top Layer w0.2: 12.43,29.46 10.92,29.46 9.85,28.39 9.81,28.39 9.65,28.23 9.65,24.26 9.33,23.93 Q7.1
  Top Layer w0.254: 12.43,29.46 12.43,30.97 R16.2 12.09,31.11 C59.1
$1N5027: length 12.4
  Top Layer w0.2: v1(13.7,30.2) R16.1
  Bottom Layer w0.2: v1(13.7,30.2) 9.04,30.2 5.72,33.53 DC_5V_POWER.2
$1N5219: length 12.5
  Top Layer w0.2: Q8.1 9.4,13.59 9.67,13.86 9.67,17.92 10.67,18.92 12.14,18.92 12.48,19.26
  Top Layer w0.254: C60.1 12.43,21.25 12.53,21.35 12.53,19.31 12.48,19.26
$1N5227: length 12.3
  Top Layer w0.2: v1(13.97,20.32) 13.97,21.24 R17.1
  Bottom Layer w0.2: USER_POWER.2 11.29,23 v1(13.97,20.32)
$1N5355: length 2.3
  Top Layer w0.254: LED1.2 24.52,12.3 R18.1
$1N5382: length 1.6
  Top Layer w0.2: R19.1 23.15,40.24 LED2.2
$1N5409: length 1.7
  Top Layer w0.2: LED3.2 23.06,25.63 R20.1
$1N5711: length 1.6
  Top Layer w0.254: R21.1 26.17,48.57 26.05,48.45
$1N5982: length 2.4
  Top Layer w0.3: 50.88,40.9 50.88,40.71 R22.1

## Copper pours and planes (outline as drawn; the poured copper is in the pictures)
GND on Top Layer: -1.14,61.47 70.99,61.47 70.99,-1.02 -1.14,-1.02
GND on Bottom Layer: -0.38,60.45 72.77,60.45 72.77,-2.41 -0.38,-2.41
PGND on Top Layer: 25.02,57.78 12.83,57.78 12.83,44.7 17.22,44.7 17.22,49.4 19.82,49.4 19.82,51.76 25.02,51.76
PGND on Bottom Layer: 25.02,57.78 12.83,57.78 12.83,44.7 17.22,44.7 17.22,49.4 19.82,49.4 19.82,51.76 25.02,51.76
DC_5V_POWER on Top Layer: 10.81,28.38 14.82,28.38 14.82,36.16 14.86,36.19 25.91,36.19 25.91,33.91 20.32,33.91 20.32,23.24 10.8,23.24 10.8,28.36
DCBUS on Top Layer: 9.41,32.92 9.41,3.18 6.1,3.18 6.1,32.92
DCBUS on Top Layer: 12.32,44.32 17.89,44.32 17.89,47.31 29.72,47.31 30.99,48.58 30.99,54.23 50.55,54.23 50.55,43.39 21.2,43.39 21.2,41.66 12.32,41.66
DCBUS on Top Layer: 5.86,57.76 12.45,57.76 12.45,32.44 5.86,32.44
DCBUS on Bottom Layer: 12.32,44.32 17.89,44.32 17.89,47.31 29.72,47.31 30.99,48.58 30.99,54.23 50.55,54.23 50.55,43.39 21.2,43.39 21.2,41.66 12.32,41.66
DCBUS on Bottom Layer: 5.86,57.76 12.45,57.76 12.45,32.44 5.86,32.44
USB_POWER on Top Layer: 9.92,6.91 13.93,6.91 13.93,9.23 25.27,9.23 25.27,5.46 19.43,5.46 19.43,1.78 9.91,1.78 9.91,6.9
USER_POWER on Top Layer: 10.55,18.09 14.57,18.09 14.57,22.95 25.65,22.95 25.65,20.57 20.07,20.57 20.07,12.95 10.54,12.95 10.54,18.08

## Text on the board
Top Silkscreen Layer: + -
